# EAGLE schematic e-ink-display-v003 (EAGLE 7.3.0)
CNAME: e-ink-display; CREVISION: 0.0.3; DESIGNER: kennethlimcp

## Sheet 1 of 4: Power supply
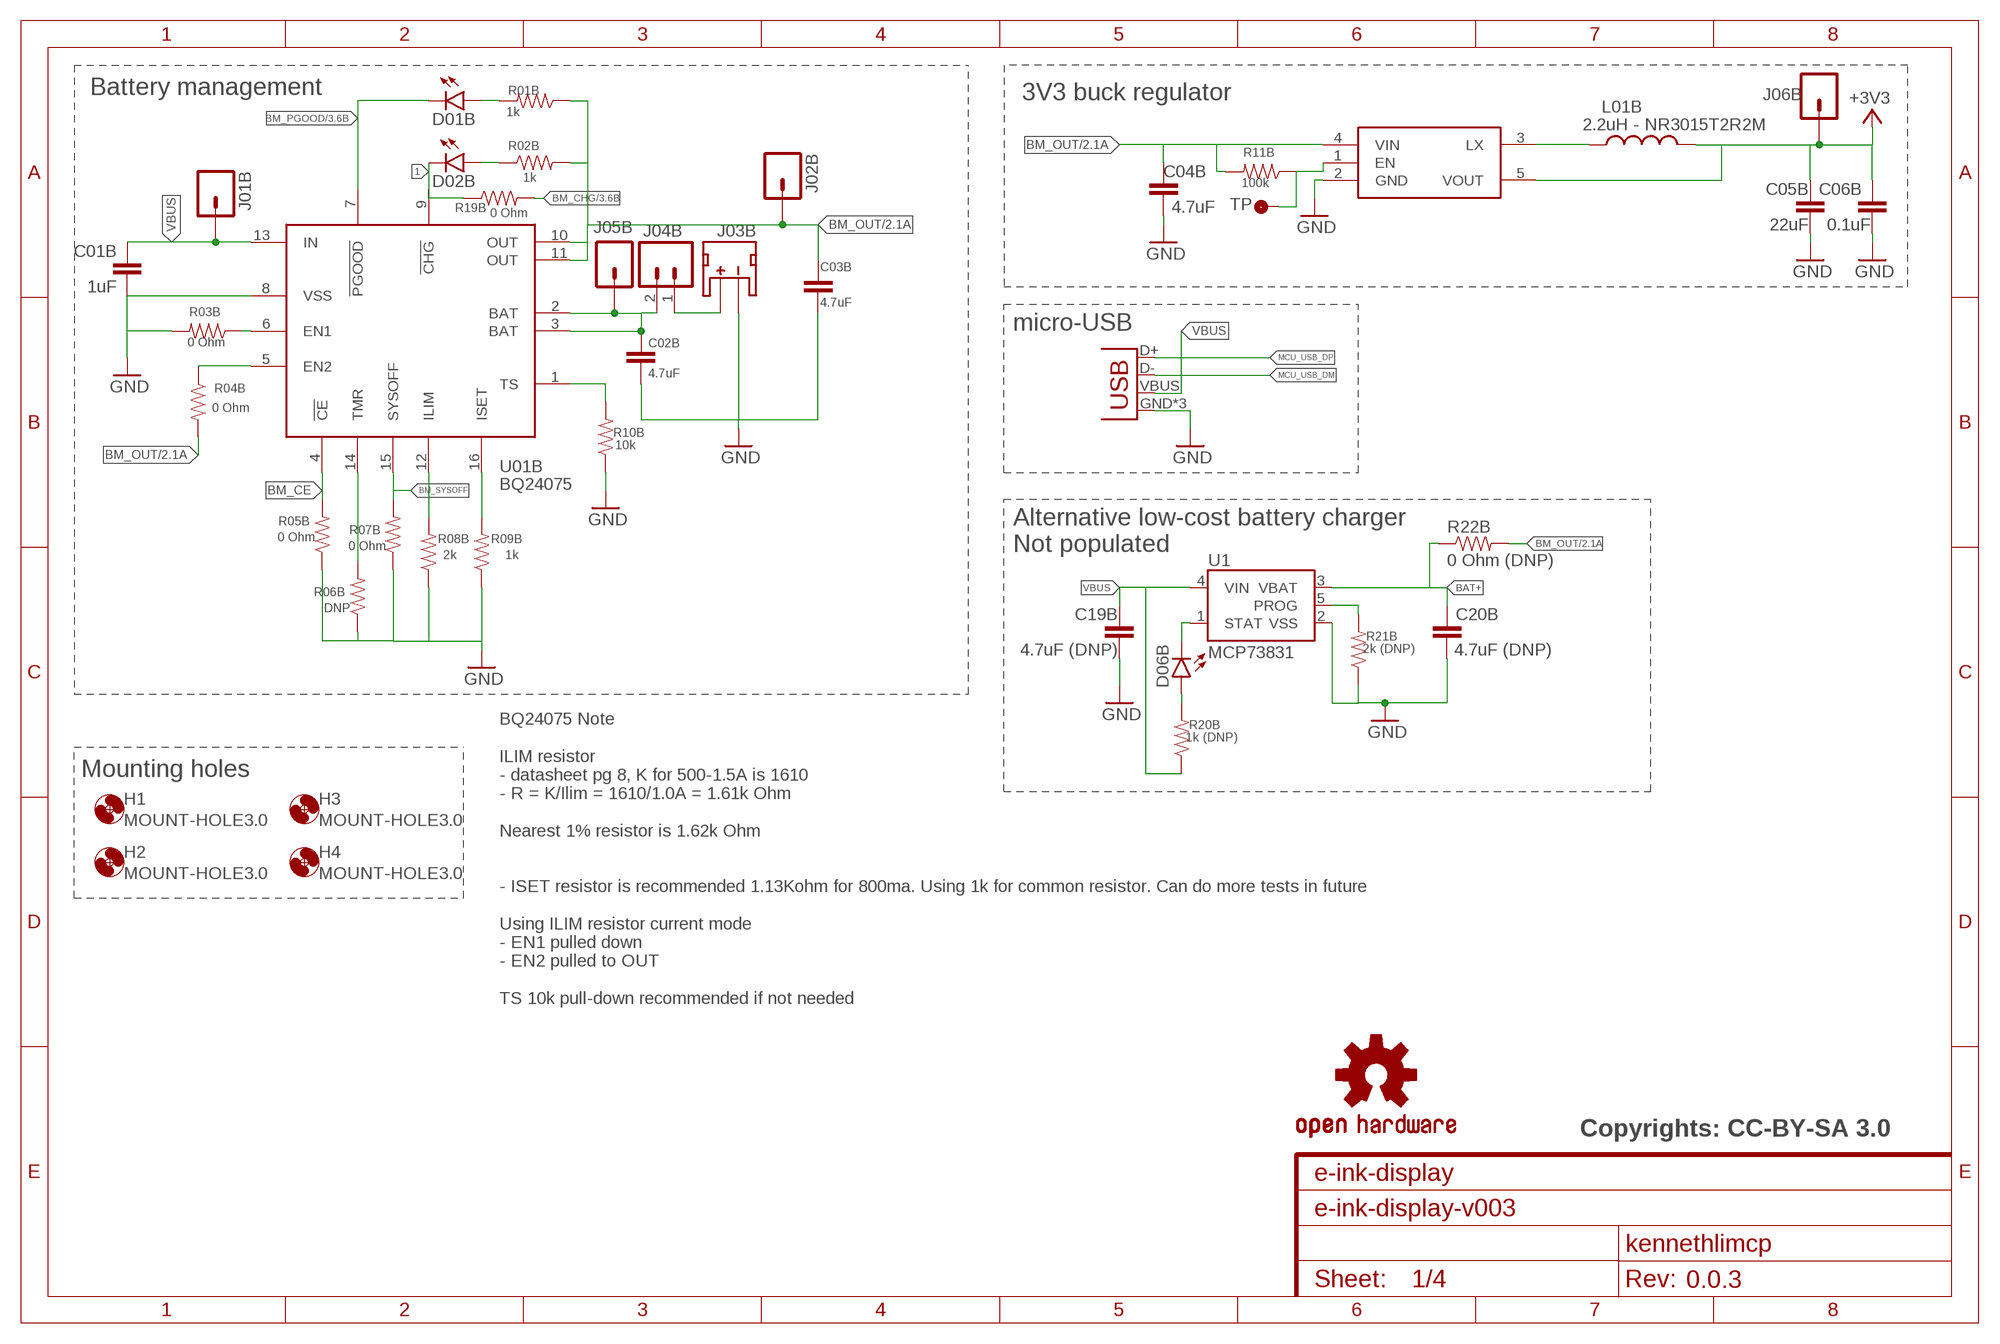
[diagram p0: schematic, sheet 1]

### Parts
C01B  1uF  CAP0603-CAP  [0603-CAP]
C02B  4.7uF  CAP0603-CAP  [0603-CAP]
C03B  4.7uF  CAP0603-CAP  [0603-CAP]
C04B  4.7uF  CAP0603-CAP  [0603-CAP]
C05B  22uF  CAP0603-CAP  [0603-CAP]
C06B  0.1uF  CAP0603-CAP  [0603-CAP]
C19B  4.7uF (DNP)  CAP0603-CAP  [0603-CAP]
C20B  4.7uF (DNP)  CAP0603-CAP  [0603-CAP]
D01B  LED0603  [LED-0603]
D02B  LED0603  [LED-0603]
D06B  LED0603  [LED-0603]
H1  MOUNT-HOLE3.0  [3,0]
H2  MOUNT-HOLE3.0  [3,0]
H3  MOUNT-HOLE3.0  [3,0]
H4  MOUNT-HOLE3.0  [3,0]
J01B  M01PTH  [1X01]
J02B  M01PTH  [1X01]
J03B  JST_2MM_MALE  [JST-2-SMD]
J04B  M02PTH  [1X02]
J05B  M01PTH  [1X01]
J06B  M01PTH  [1X01]
J07B  USBUSB-MICROB-SLOT-HOLE  [USB-MICROB-SLOT-HOLE]
L01B  2.2uH - NR3015T2R2M  INDUCTOR-SPARKFUNNR3015T4R7M  [INDUCTOR-NR3015]
LOGO1  OSHW-LOGOPAD  [OSHW-LOGO-M-PAD]
R01B  1k  RESISTOR0603-RES  [0603-RES]
R02B  1k  RESISTOR0603-RES  [0603-RES]
R03B  0 Ohm  RESISTOR0603-RES  [0603-RES]
R04B  0 Ohm  RESISTOR0603  [0603-RES]
R05B  0 Ohm  RESISTOR0603  [0603-RES]
R06B  DNP  RESISTOR0603  [0603-RES]
R07B  0 Ohm  RESISTOR0603  [0603-RES]
R08B  2k  RESISTOR0603  [0603-RES]
R09B  1k  RESISTOR0603-RES  [0603-RES]
R10B  10k  RESISTOR0603  [0603-RES]
R11B  100k  RESISTOR0603  [0603-RES]
R19B  0 Ohm  RESISTOR0603  [0603-RES]
R20B  1k (DNP)  RESISTOR0603  [0603-RES]
R21B  2k (DNP)  RESISTOR0603  [0603-RES]
R22B  0 Ohm (DNP)  RESISTOR1206  [1206]
TP01B  TP1  [TP35_BOT]
U1  MCP73831  [SOT23-5]
U01B  BQ24075  [QFN-16]
U02B  R8008-33  [SOT23-5]

### Nets
1: D02B.C R19B.1 U01B.9(!CHG)
+3V3: C05B.2 C06B.2 J06B.1 L01B.2 U02B.5(VOUT) ; also sheet 3,4
BAT+: C20B.2 J03B.2(+) J04B.1 R22B.1 U1.3(VBAT)
BM_BAT: C02B.2 J04B.2 J05B.1 U01B.2(BAT) U01B.3(BAT)
BM_CE: R05B.2 U01B.4(!CE)
BM_CHG: R19B.2 ; also sheet 3
BM_OUT: C03B.2 C04B.2 J02B.1 R01B.1 R02B.2 R04B.2 R11B.2 R22B.2 U01B.10(OUT) U01B.11(OUT) U02B.4(VIN) ; also sheet 2
BM_PGOOD: D01B.C U01B.7(!PGOOD) ; also sheet 3
BM_SYSOFF: R07B.2 U01B.15(SYSOFF)
GND: C01B.1 C02B.1 C03B.1 C04B.1 C05B.1 C06B.1 C19B.1 C20B.1 J03B.1(-) J07B.GND J07B.MT1(GND) J07B.MT2(GND) R03B.2 R05B.1 R06B.1 R07B.1 R08B.1 R09B.1 R10B.1 R21B.1 U1.2(VSS) U01B.8(VSS) U02B.2(GND) ; also sheet 2,3,4
MCU_USB_DM: J07B.D-
MCU_USB_DP: J07B.D+
N$4: R08B.2 U01B.12(ILIM)
N$9: R09B.2 U01B.16(ISET)
N$11: R04B.1 U01B.5(EN2)
N$12: R03B.1 U01B.6(EN1)
N$13: R06B.2 U01B.14(TMR)
N$15: R10B.2 U01B.1(TS)
N$17: D02B.A R02B.1
N$18: D01B.A R01B.2
N$19: R21B.2 U1.5(PROG)
N$21: R11B.1 TP01B.P$1(TP) U02B.1(EN)
N$23: L01B.1 U02B.3(LX)
N$30: D06B.C U1.1(STAT)
N$37: D06B.A R20B.2
VBUS: C01B.2 C19B.2 J01B.1 J07B.VBUS R20B.1 U1.4(VIN) U01B.13(IN)
Unconnected: J03B.NC1(PAD1) J03B.NC2(PAD2)

### Notes on the sheet
- Battery management | 3V3 buck regulator
- micro-USB
- Alternative low-cost battery charger
  Not populated
- Mounting holes
- BQ24075 Note
  
  ILIM resistor
  - datasheet pg 8, K for 500-1.5A is 1610
  - R = K/Ilim = 1610/1.0A = 1.61k Ohm
  
  Nearest 1% resistor is 1.62k Ohm
  
  
  - ISET resistor is recommended 1.13Kohm for 800ma. Using 1k for common resistor. Can do more tests in future
  
  Using ILIM resistor current mode
  - EN1 pulled down
  - EN2 pulled to OUT
  
  TS 10k pull-down recommended if not needed
- Copyrights: CC-BY-SA 3.0

## Sheet 2 of 4: e-ink power supply
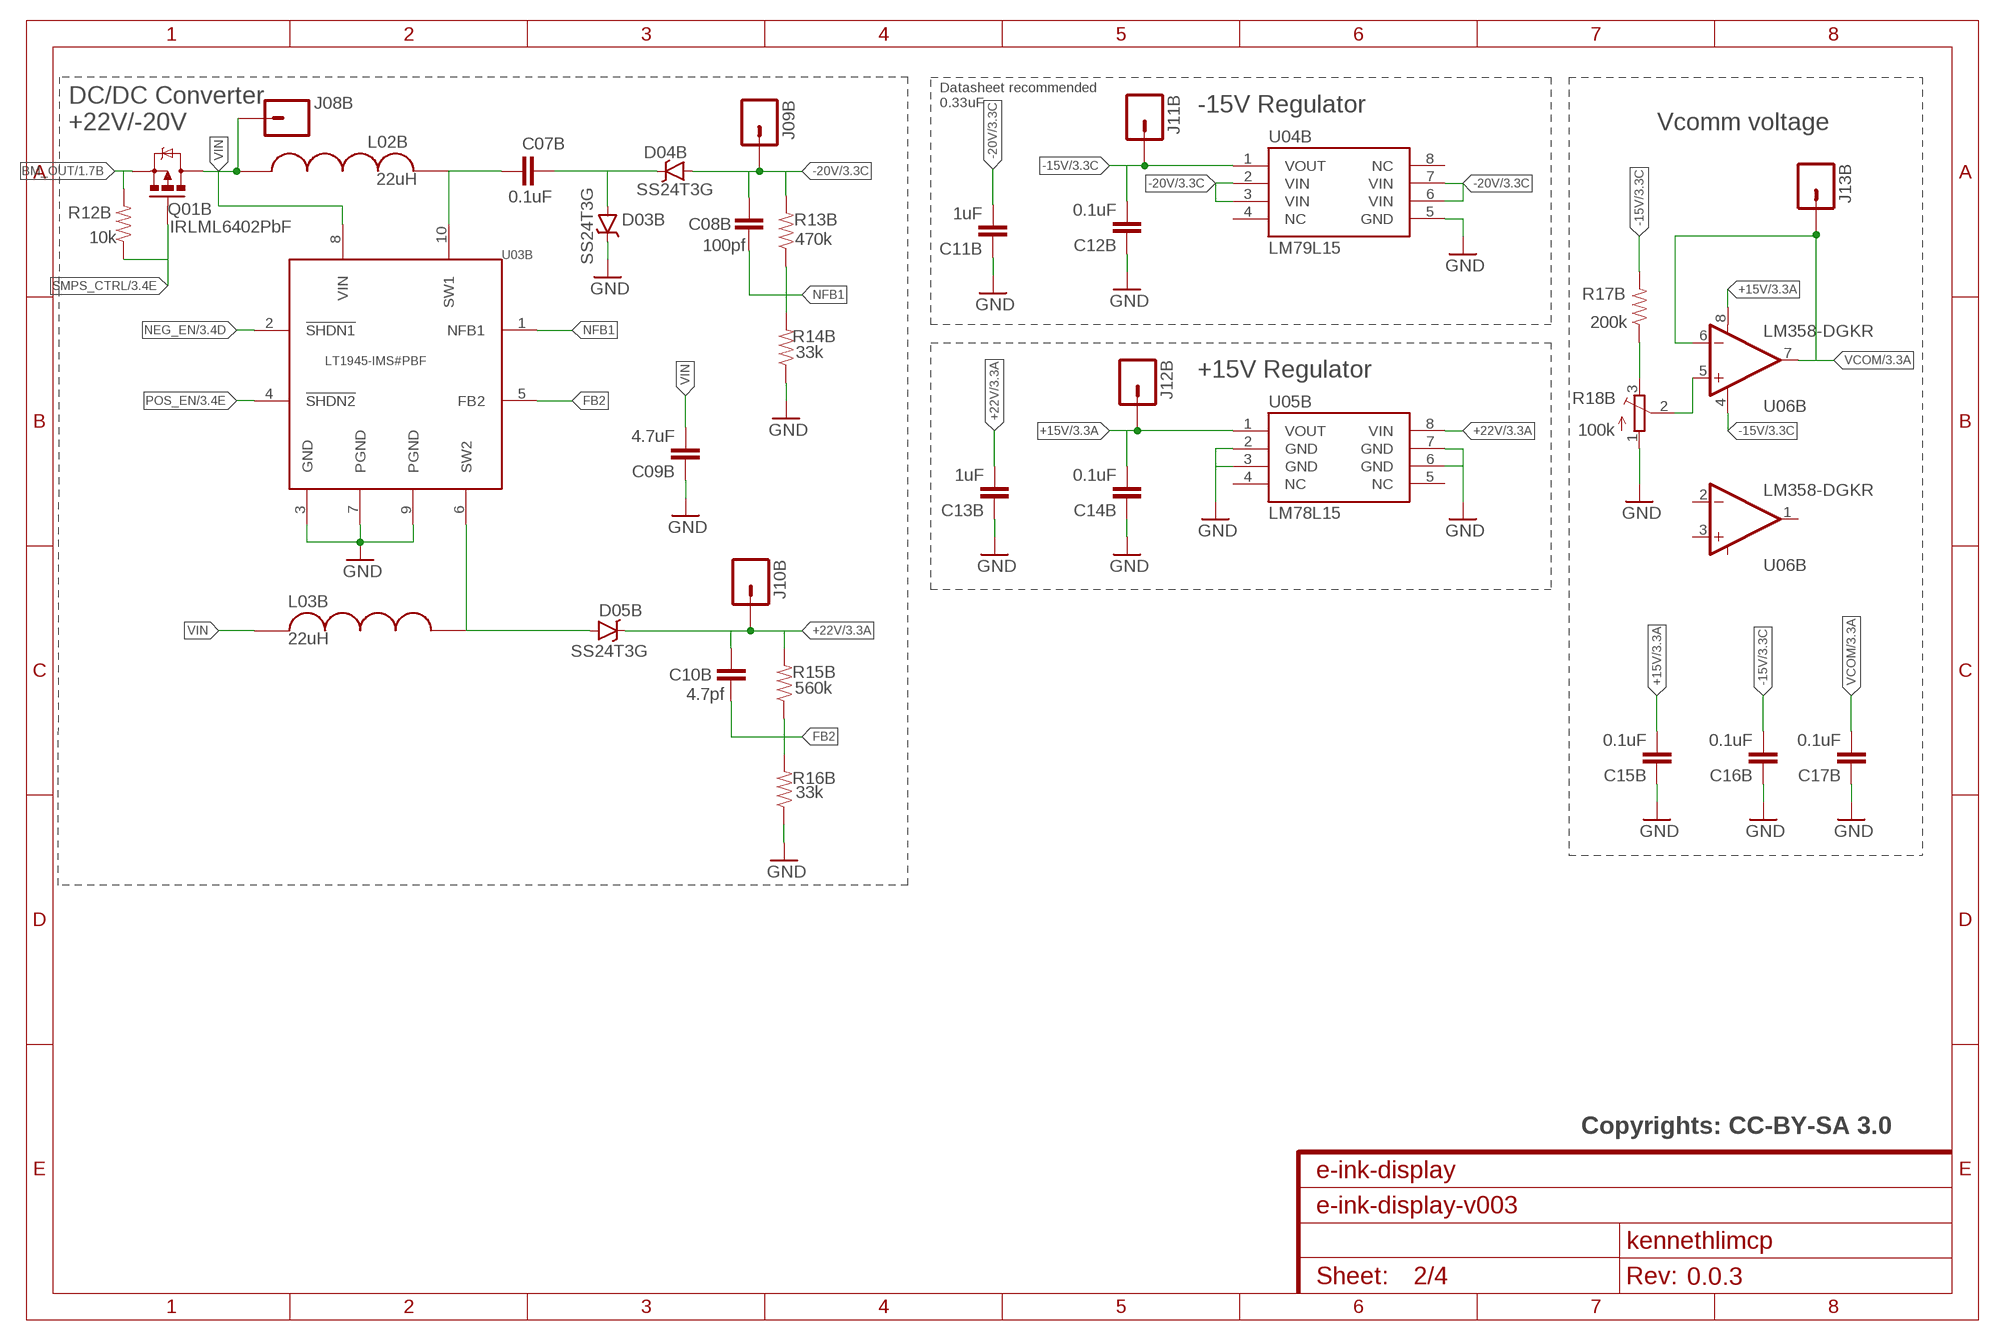
[diagram p1: schematic, sheet 2]

### Parts
C07B  0.1uF  CAP0603-CAP  [0603-CAP]
C08B  100pf  CAP0603-CAP  [0603-CAP]
C09B  4.7uF  CAP0603-CAP  [0603-CAP]
C10B  4.7pf  CAP0603-CAP  [0603-CAP]
C11B  1uF  CAP0603-CAP  [0603-CAP]
C12B  0.1uF  CAP0603-CAP  [0603-CAP]
C13B  1uF  CAP0603-CAP  [0603-CAP]
C14B  0.1uF  CAP0603-CAP  [0603-CAP]
C15B  0.1uF  CAP0603-CAP  [0603-CAP]
C16B  0.1uF  CAP0603-CAP  [0603-CAP]
C17B  0.1uF  CAP0603-CAP  [0603-CAP]
D03B  SS24T3G  [SMA-DIODE]
D04B  SS24T3G  [SMA-DIODE]
D05B  SS24T3G  [SMA-DIODE]
J08B  M01PTH  [1X01]
J09B  M01PTH  [1X01]
J10B  M01PTH  [1X01]
J11B  M01PTH  [1X01]
J12B  M01PTH  [1X01]
J13B  M01PTH  [1X01]
L02B  22uH  INDUCTOR  [4040(1515)]
L03B  22uH  INDUCTOR  [4040(1515)]
Q01B  IRLML6402PbF  MOSFET-PCHANNELSMD  [SOT23-3]
R12B  10k  RESISTOR0603  [0603-RES]
R13B  470k  RESISTOR0603  [0603-RES]
R14B  33k  RESISTOR0603  [0603-RES]
R15B  560k  RESISTOR0603  [0603-RES]
R16B  33k  RESISTOR0603  [0603-RES]
R17B  200k  RESISTOR0603  [0603-RES]
R18B  100k  TRIMPOTTC33X  [TC33X]
U03B  LT1945-IMS#PBF  [MSOP-10]
U04B  LM79L15  [SO08]
U05B  LM78L15  [SO08]
U06B  LM358-DGKR  [MSOP-8]

### Nets
+15V: C14B.2 C15B.2 J12B.1 U05B.1(VOUT) U06B.8(V+) ; also sheet 3
+22V: C10B.2 C13B.2 D05B.C J10B.1 R15B.2 U05B.8(VIN) ; also sheet 3
-15V: C12B.2 C16B.2 J11B.1 R17B.2 U04B.1(VOUT) U06B.4(V-) ; also sheet 3
-20V: C08B.2 C11B.2 D04B.A J09B.1 R13B.2 U04B.2(VIN) U04B.3(VIN) U04B.6(VIN) U04B.7(VIN) ; also sheet 3
BM_OUT: Q01B.2(S) R12B.2 ; also sheet 1
FB2: C10B.1 R15B.1 R16B.2 U03B.5(FB2)
GND: C09B.1 C11B.1 C12B.1 C13B.1 C14B.1 C15B.1 C16B.1 C17B.1 D03B.C R14B.1 R16B.1 R18B.1(A) U03B.3(GND) U03B.7(PGND) U03B.9(PGND) U04B.5(GND) U05B.2(GND) U05B.3(GND) U05B.6(GND) U05B.7(GND) ; also sheet 1,3,4
N$2: C07B.1 L02B.P$2 U03B.10(SW1)
N$3: C07B.2 D03B.A D04B.C
N$6: R18B.2(S) U06B.5(+IN2)
N$7: R17B.1 R18B.3(E)
N$8: D05B.A L03B.P$2 U03B.6(SW2)
NEG_EN: U03B.2(!SHDN1) ; also sheet 3
NFB1: C08B.1 R13B.1 R14B.2 U03B.1(NFB1)
POS_EN: U03B.4(!SHDN2) ; also sheet 3
SMPS_CTRL: Q01B.1(G) R12B.1 ; also sheet 3
VCOM: C17B.2 J13B.1 U06B.6(-IN2) U06B.7(OUT2) ; also sheet 3
VIN: C09B.2 J08B.1 L02B.P$1 L03B.P$1 Q01B.3(D) U03B.8(VIN)
Unconnected: U04B.4(NC) U04B.8(NC) U05B.4(NC) U05B.5(NC) U06B.1(OUT1) U06B.2(-IN1) U06B.3(+IN1)

### Notes on the sheet
- Datasheet recommended
  0.33uF
- -15V Regulator
- DC/DC Converter
  +22V/-20V
- Vcomm voltage
- +15V Regulator
- Copyrights: CC-BY-SA 3.0

## Sheet 3 of 4: e-ink display & MCU
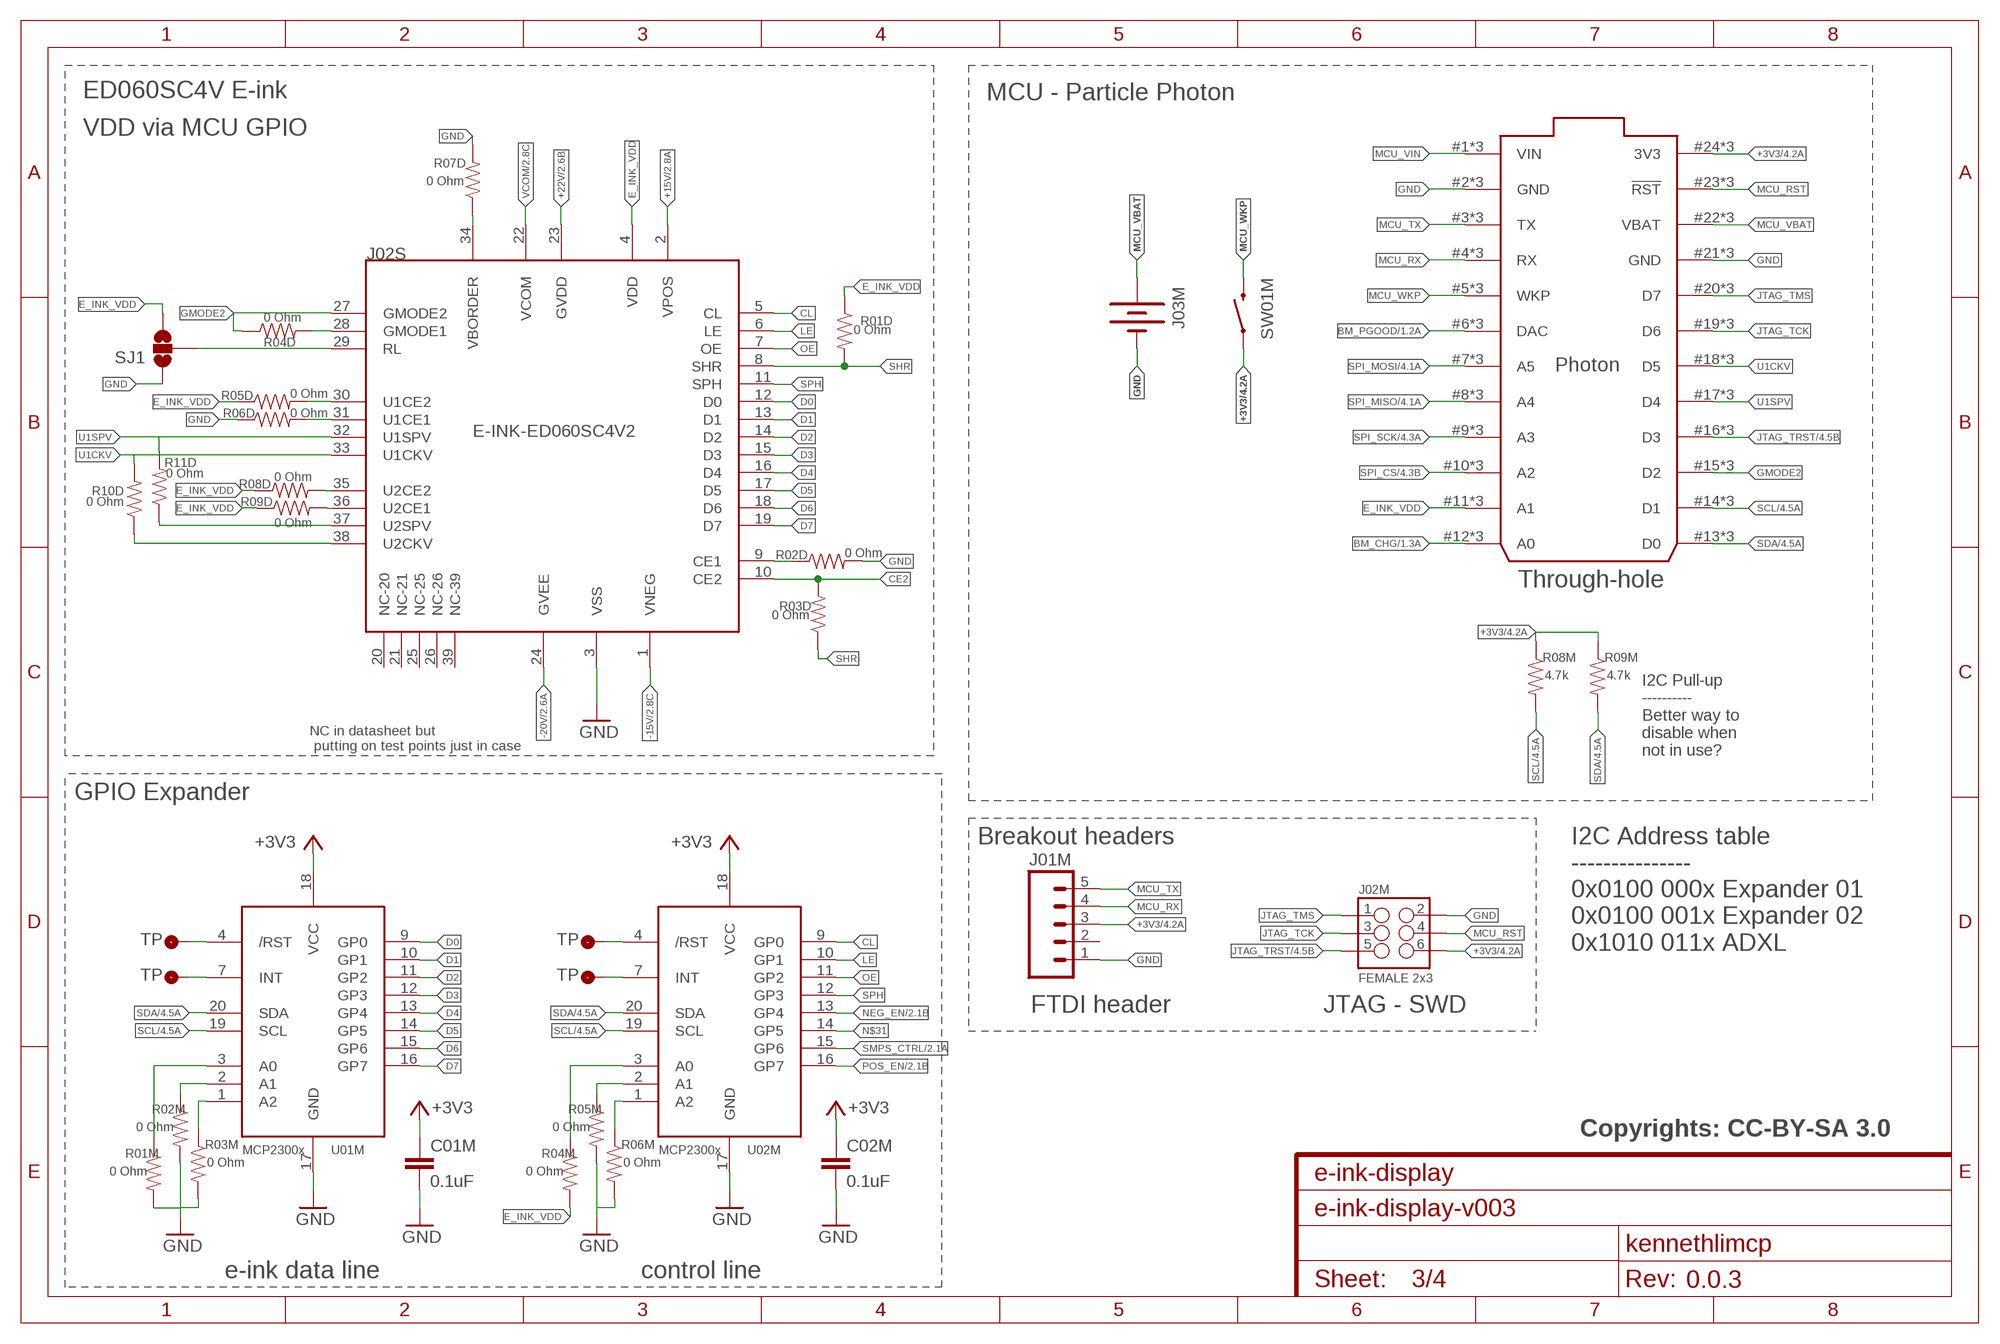
[diagram p2: schematic, sheet 3]

### Parts
C01M  0.1uF  CAP0603-CAP  [0603-CAP]
C02M  0.1uF  CAP0603-CAP  [0603-CAP]
J01M  M05PTH  [1X05]
J02M  FEMALE 2x3  M03X2FEMALE  [2X3]
J02S  E-INK-ED060SC4V2  [FPC-0.3-39]
J03M  BATTERY20PTH  [BATTCOM_20MM_PTH]
R01D  0 Ohm  RESISTOR0603-RES  [0603-RES]
R01M  0 Ohm  RESISTOR0603-RES  [0603-RES]
R02D  0 Ohm  RESISTOR0603-RES  [0603-RES]
R02M  0 Ohm  RESISTOR0603-RES  [0603-RES]
R03D  0 Ohm  RESISTOR0603-RES  [0603-RES]
R03M  0 Ohm  RESISTOR0603-RES  [0603-RES]
R04D  0 Ohm  RESISTOR0603-RES  [0603-RES]
R04M  0 Ohm  RESISTOR0603-RES  [0603-RES]
R05D  0 Ohm  RESISTOR0603-RES  [0603-RES]
R05M  0 Ohm  RESISTOR0603-RES  [0603-RES]
R06D  0 Ohm  RESISTOR0603-RES  [0603-RES]
R06M  0 Ohm  RESISTOR0603-RES  [0603-RES]
R07D  0 Ohm  RESISTOR0603-RES  [0603-RES]
R08D  0 Ohm  RESISTOR0603-RES  [0603-RES]
R08M  4.7k  RESISTOR0603-RES  [0603-RES]
R09D  0 Ohm  RESISTOR0603-RES  [0603-RES]
R09M  4.7k  RESISTOR0603-RES  [0603-RES]
R10D  0 Ohm  RESISTOR0603-RES  [0603-RES]
R11D  0 Ohm  RESISTOR0603-RES  [0603-RES]
SJ1  SOLDERJUMPER_2WAYT  [SJ_2]
SW01M  SWITCH-MOMENTARY-2PTH  [TACTILE-PTH]
U01M  MCP2300X/QFN  [QFN-20(4X4)]
U02M  MCP2300X/QFN  [QFN-20(4X4)]
U03M  PHOTON_WITH_STACKABLE_HEADERS  [PHOTON_STACKABLE]
U$1  TP1  [TP35_BOT]
U$2  TP1  [TP35_BOT]
U$3  TP1  [TP35_BOT]
U$4  TP1  [TP35_BOT]

### Nets
+3V3: C01M.1 C02M.1 J01M.3 J02M.6 R08M.1 R09M.1 SW01M.1 U01M.18(VCC) U02M.18(VCC) U03M.24(3V3) U03M.#24(3V3) U03M.@24(3V3) ; also sheet 1,4
+15V: J02S.2(VPOS) ; also sheet 2
+22V: J02S.23(GVDD) ; also sheet 2
-15V: J02S.1(VNEG) ; also sheet 2
-20V: J02S.24(GVEE) ; also sheet 2
BM_CHG: U03M.12(A0) U03M.#12(A0) U03M.@12(A0) ; also sheet 1
BM_PGOOD: U03M.6(DAC) U03M.#6(DAC) U03M.@6(DAC) ; also sheet 1
CE2: J02S.10(CE2) R03D.2
CL: J02S.5(CL) U02M.9(GP0)
D0: J02S.12(D0) U01M.9(GP0)
D1: J02S.13(D1) U01M.10(GP1)
D2: J02S.14(D2) U01M.11(GP2)
D3: J02S.15(D3) U01M.12(GP3)
D4: J02S.16(D4) U01M.13(GP4)
D5: J02S.17(D5) U01M.14(GP5)
D6: J02S.18(D6) U01M.15(GP6)
D7: J02S.19(D7) U01M.16(GP7)
E_INK_VDD: J02S.4(VDD) R01D.1 R04M.2 R05D.1 R08D.1 R09D.1 SJ1.3 U03M.11(A1) U03M.#11(A1) U03M.@11(A1)
GMODE2: J02S.27(GMODE2) R04D.1 U03M.15(D2) U03M.#15(D2) U03M.@15(D2)
GND: C01M.2 C02M.2 J01M.1 J02M.2 J02S.3(VSS) J03M.2(-) R01M.2 R02D.2 R02M.2 R03M.2 R05M.2 R06D.1 R06M.2 R07D.2 SJ1.1 U01M.17(GND) U02M.17(GND) U03M.2(GND) U03M.21(GND) U03M.#2(GND) U03M.#21(GND) U03M.@2(GND) U03M.@21(GND) ; also sheet 1,2,4
JTAG_TCK: J02M.3 U03M.19(D6) U03M.#19(D6) U03M.@19(D6)
JTAG_TMS: J02M.1 U03M.20(D7) U03M.#20(D7) U03M.@20(D7)
JTAG_TRST: J02M.5 U03M.16(D3) U03M.#16(D3) U03M.@16(D3) ; also sheet 4
LE: J02S.6(LE) U02M.10(GP1)
MCU_RST: J02M.4 U03M.23(!RST) U03M.#23(!RST) U03M.@23(!RST)
MCU_RX: J01M.4 U03M.4(RX) U03M.#4(RX) U03M.@4(RX)
MCU_TX: J01M.5 U03M.3(TX) U03M.#3(TX) U03M.@3(TX)
MCU_VBAT: J03M.1(+) U03M.22(VBAT) U03M.#22(VBAT) U03M.@22(VBAT)
MCU_VIN: U03M.1(VIN) U03M.#1(VIN) U03M.@1(VIN)
MCU_WKP: SW01M.3 U03M.5(WKP) U03M.#5(WKP) U03M.@5(WKP)
N$1: J02S.28(GMODE1) R04D.2
N$5: J02S.31(U1CE1) R06D.2
N$14: U01M.4(/RST) U$1.P$1(TP)
N$16: U01M.7(INT) U$2.P$1(TP)
N$20: U02M.4(/RST) U$3.P$1(TP)
N$22: U02M.7(INT) U$4.P$1(TP)
N$24: R03M.1 U01M.1(A2)
N$25: R01M.1 U01M.3(A0)
N$26: J02S.35(U2CE2) R08D.2
N$27: J02S.36(U2CE1) R09D.2
N$28: J02S.9(CE1) R02D.1
N$29: J02S.34(VBORDER) R07D.1
N$31: U02M.14(GP5)
N$32: R06M.1 U02M.1(A2)
N$33: R05M.1 U02M.2(A1)
N$34: R04M.1 U02M.3(A0)
N$35: R02M.1 U01M.2(A1)
NEG_EN: U02M.13(GP4) ; also sheet 2
OE: J02S.7(OE) U02M.11(GP2)
POS_EN: U02M.16(GP7) ; also sheet 2
RL: J02S.29(RL) SJ1.2
SCL: R08M.2 U01M.19(SCL) U02M.19(SCL) U03M.14(D1) U03M.#14(D1) U03M.@14(D1) ; also sheet 4
SDA: R09M.2 U01M.20(SDA) U02M.20(SDA) U03M.13(D0) U03M.#13(D0) U03M.@13(D0) ; also sheet 4
SHR: J02S.8(SHR) R01D.2 R03D.1
SMPS_CTRL: U02M.15(GP6) ; also sheet 2
SPH: J02S.11(SPH) U02M.12(GP3)
SPI_CS: U03M.10(A2) U03M.#10(A2) U03M.@10(A2) ; also sheet 4
SPI_MISO: U03M.8(A4) U03M.#8(A4) U03M.@8(A4) ; also sheet 4
SPI_MOSI: U03M.7(A5) U03M.#7(A5) U03M.@7(A5) ; also sheet 4
SPI_SCK: U03M.9(A3) U03M.#9(A3) U03M.@9(A3) ; also sheet 4
U1CE2: J02S.30(U1CE2) R05D.2
U1CKV: J02S.33(U1CKV) R10D.2 U03M.18(D5) U03M.#18(D5) U03M.@18(D5)
U1SPV: J02S.32(U1SPV) R11D.2 U03M.17(D4) U03M.#17(D4) U03M.@17(D4)
U2CKV: J02S.38(U2CKV) R10D.1
U2SPV: J02S.37(U2SPV) R11D.1
VCOM: J02S.22(VCOM) ; also sheet 2
Unconnected: J01M.2 J02S.20(NC-20) J02S.21(NC-21) J02S.25(NC-25) J02S.26(NC-26) J02S.39(NC-39)

### Notes on the sheet
- MCU - Particle Photon
- ED060SC4V E-ink
  
  VDD via MCU GPIO
- Through-hole
- NC in datasheet but
   putting on test points just in case
- I2C Pull-up
  ----------
  Better way to 
  disable when 
  not in use?
- GPIO Expander
- Breakout headers
- I2C Address table
  ---------------
  0x0100 000x Expander 01
  0x0100 001x Expander 02
  0x1010 011x ADXL
- FTDI header | JTAG - SWD
- Copyrights: CC-BY-SA 3.0
- e-ink data line | control line

## Sheet 4 of 4: Peripherals
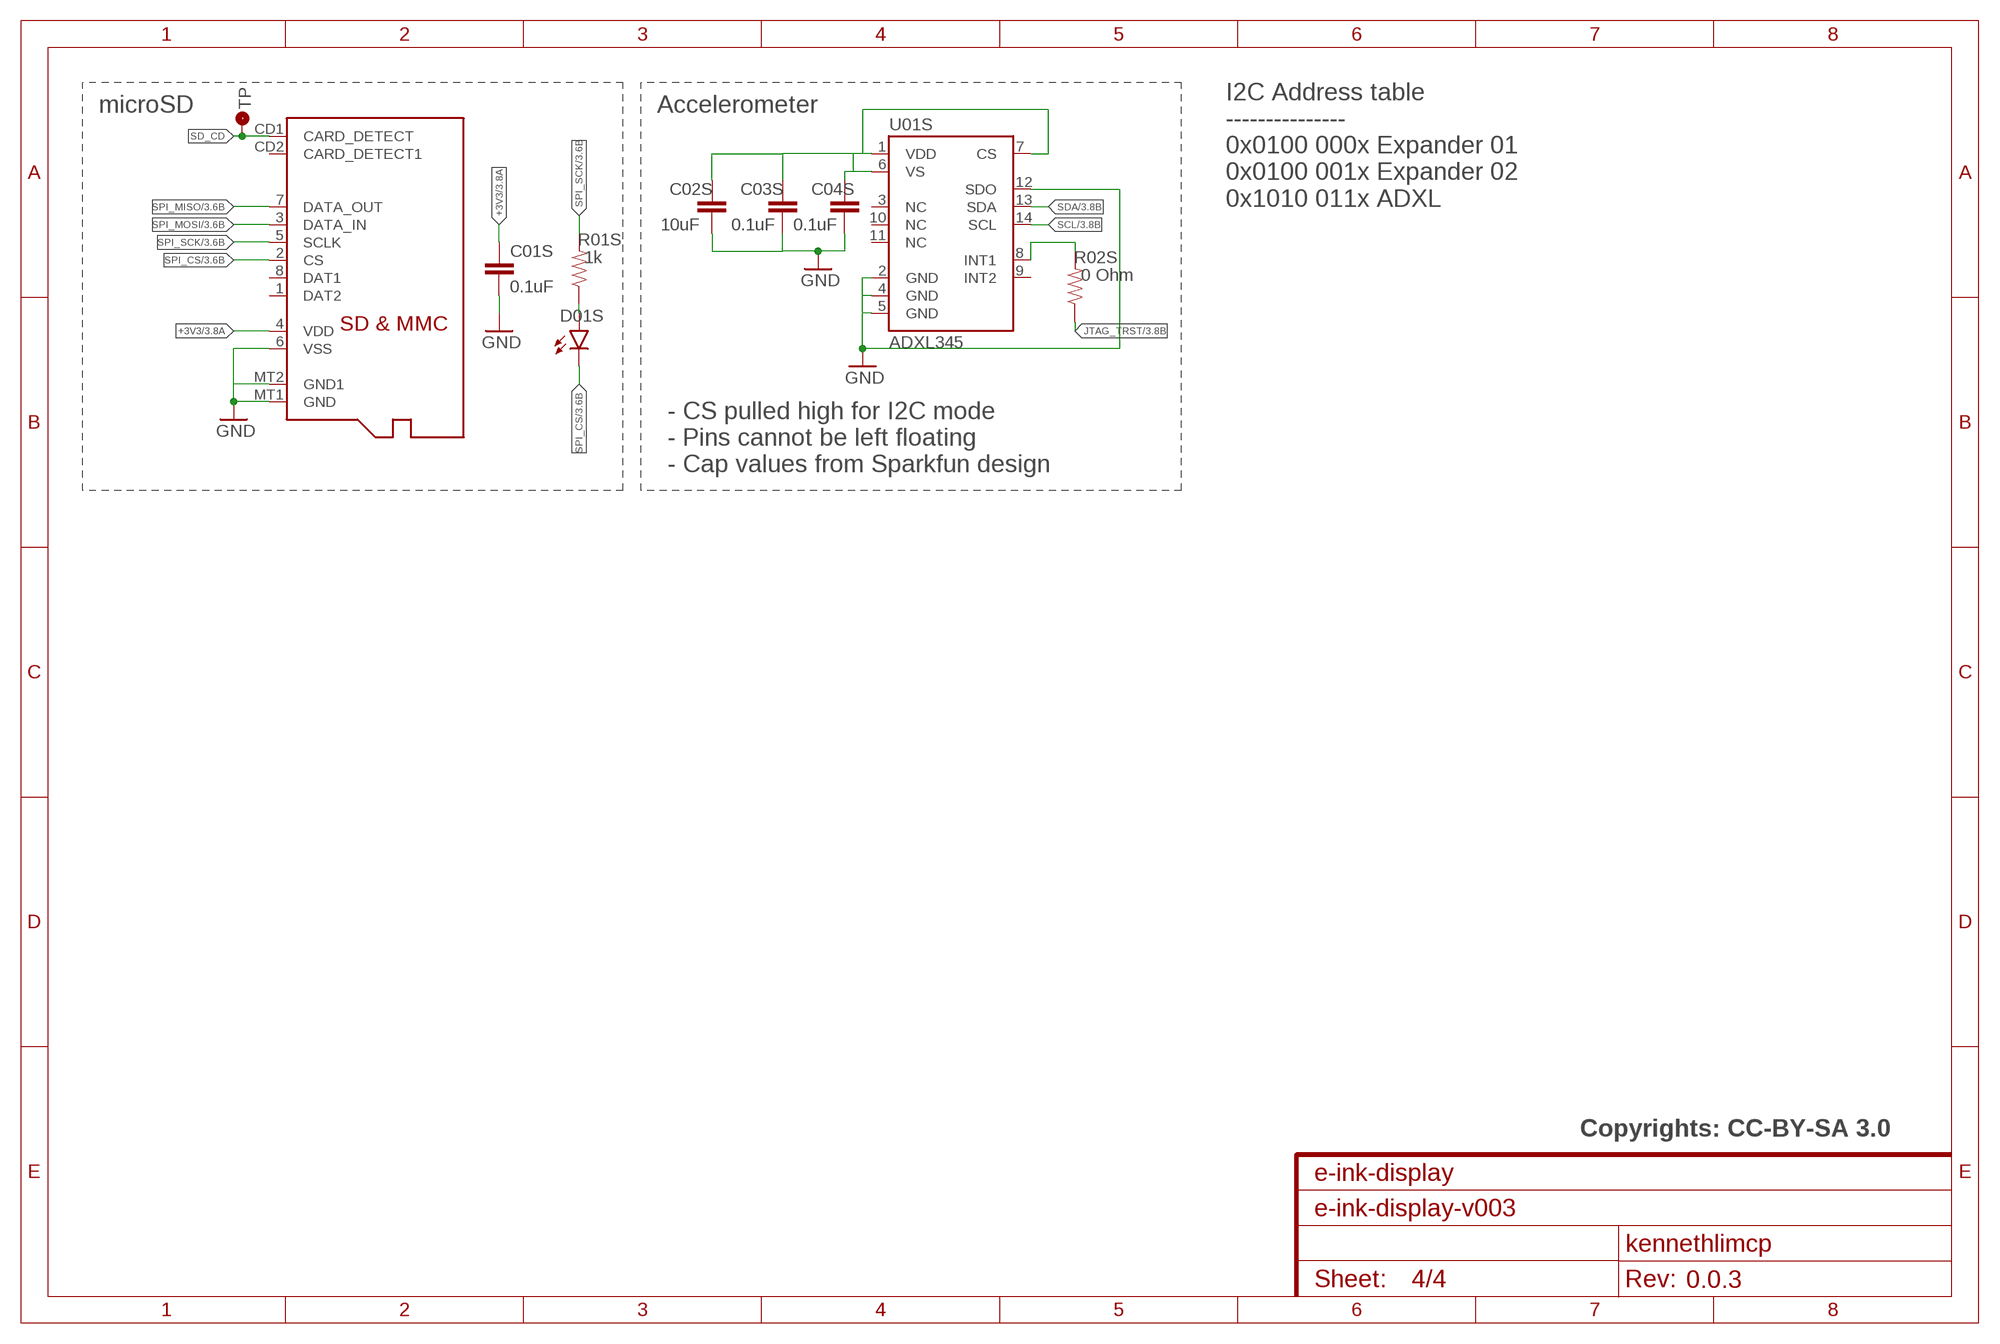
[diagram p3: schematic, sheet 4]

### Parts
C01S  0.1uF  CAP0603-CAP  [0603-CAP]
C02S  10uF  CAP0603-CAP  [0603-CAP]
C03S  0.1uF  CAP0603-CAP  [0603-CAP]
C04S  0.1uF  CAP0603-CAP  [0603-CAP]
D01S  LED0603  [LED-0603]
J01S  MICROSD  [MICROSD]
R01S  1k  RESISTOR0603-RES  [0603-RES]
R02S  0 Ohm  RESISTOR0603  [0603-RES]
U01S  ADXL345  [LGA14]
U$5  TP3  [TP60_BOT]

### Nets
+3V3: C01S.1 J01S.4(VDD) ; also sheet 1,3
GND: C01S.2 C02S.2 C03S.2 C04S.2 J01S.6(VSS) J01S.MT1(GND) J01S.MT2(GND1) U01S.2(GND) U01S.4(GND) U01S.5(GND) U01S.12(SDO) ; also sheet 1,2,3
JTAG_TRST: R02S.1 ; also sheet 3
N$10: R02S.2 U01S.8(INT1)
N$36: C02S.1 C03S.1 C04S.1 U01S.1(VDD) U01S.6(VS) U01S.7(CS)
R01S: D01S.A R01S.1
SCL: U01S.14(SCL) ; also sheet 3
SD_CD: J01S.CD1(CARD_DETECT) U$5.P$1(TP)
SDA: U01S.13(SDA) ; also sheet 3
SPI_CS: D01S.C J01S.2(CS) ; also sheet 3
SPI_MISO: J01S.7(DATA_OUT) ; also sheet 3
SPI_MOSI: J01S.3(DATA_IN) ; also sheet 3
SPI_SCK: J01S.5(SCLK) R01S.2 ; also sheet 3
Unconnected: J01S.1(DAT2) J01S.8(DAT1) J01S.CD2(CARD_DETECT1) U01S.3(NC) U01S.9(INT2) U01S.10(NC) U01S.11(NC)

### Notes on the sheet
- microSD | Accelerometer
- I2C Address table
  ---------------
  0x0100 000x Expander 01
  0x0100 001x Expander 02
  0x1010 011x ADXL
- - CS pulled high for I2C mode
  - Pins cannot be left floating
  - Cap values from Sparkfun design
- Copyrights: CC-BY-SA 3.0

## Library data of the parts
C01B C01M C01S C02B C02M C02S C03B C03S C04B C04S C05B C06B C07B C08B C09B C10B C11B C12B C13B C14B C15B C16B C17B C19B C20B = SparkFun-Capacitors:CAP: Capacitor Standard 0603 ceramic capacitor, and 0.1" leaded capacitor.
D01B D01S D02B D06B = SparkFun-LED:LED: LEDs Standard schematic elements and footprints for 5mm, 3mm, 1206, and 0603 sized LEDs. 5mm - Spark Fun Electronics SKU : COM-00529 (and others)
D03B D04B D05B = kennethlimcp:SS24T3G: SS24T3G, Schottky diode 40V, 1A, Vf 500mV Package: DO-214AA
H1-H4 = holes:MOUNT-HOLE: MOUNTING HOLE with drill center marker
J01B J02B J05B J06B J08B J09B J10B J11B J12B J13B = SparkFun-Connectors:M01: Header 1 Standard 1-pin 0.1" header. Use with straight break away headers (SKU : PRT-00116), right angle break away headers (PRT-00553), swiss pins (PRT-00743), machine pins (PRT-00117), and female headers (PRT-00115).
J01M = SparkFun-Connectors:M05: Header 5 Standard 5-pin 0.1" header. Use with straight break away headers (SKU : PRT-00116), right angle break away headers (PRT-00553), swiss pins (PRT-00743), machine pins (PRT-00117), and female headers (PRT-00115). Molex polarized connector foot print use with SKU : PRT-08230 with associated crimp pins and housings.
J01S = adafruit:MICROSD: Micro-SD / Transflash card holder with SPI pinout For the 3M # 2908-05WB-MG and/or 4UCON #19656 push-push type
J02M = SparkFun-Connectors:M03X2: 2x3 .1" header. Shrouded, with keying- CONN-10681 SMT- CONN-11415 Pogo pins- HW-11044; PROD_ID: CONN-11566
J02S = kennethlimcp:E-INK-ED060SC4V2
J03B = SparkFun-Connectors:JST_2MM_MALE: Mates to single-cell LiPo batteries. CONN-11443 Now with smashable polarity marks!; BTM_NEG: -; BTM_POS: +; PROD_ID: CONN-11443; TOP_NEG: -; TOP_POS: +
J03M = SparkFun-Electromechanical:BATTERY: Battery Holders Various common sizes : AA, AAA, 18650 (PRT-12895), 20mm coin cell and 12mm coin cell. 20MM_4LEGS, BATT-10373
J04B = SparkFun-Connectors:M02: Standard 2-pin 0.1" header. Use with - straight break away headers ( PRT-00116) - right angle break away headers (PRT-00553) - swiss pins (PRT-00743) - machine pins (PRT-00117) - female headers (PRT-00115) Molex polarized connector foot print use with: PRT-08233 with associated crimp pins and housings. 2.54_SCREWTERM for use with PRT-10571. 3.5mm Screw Terminal footprints for PRT-08084 5mm Screw Terminal footprints for use with PRT-08432
J07B = Spark:USB
L01B = Spark:INDUCTOR-SPARKFUN: Inductors Basic Inductor/Choke - 0603 and 1206. Footprints are not proven and vary greatly between part numbers. SRN6045- 33uH, 20% 1.4A; NR3015T4R7M: 4.7uH
L02B L03B = kennethlimcp:INDUCTOR
LOGO1 = kennethlimcp:OSHW-LOGO: Open Source Hardware Logo This logo indicates the piece of hardware it is found on incorporates a OSHW license and/or adheres to the definition of open source hardware found here: http://freedomdefined.org/OSHW
Q01B = SparkFun-DiscreteSemi:MOSFET-PCHANNEL: Generic PMOSFET IRLML2244 - TRANS-11153 (SOT-23 -20V -4.3A) (1.Gate 2.Source 3.Drain) FQP27P06 - COM-10349 <http://www.sparkfun.com/products/10349> (TO-220 -60V -27A) (1.Gate 2.Source 3.Drain)
R01B R01S R02B R02S R03B R04B R05B R06B R07B R08B R09B R10B R11B R12B R13B R14B R15B R16B R17B R19B R20B R21B R22B = SparkFun-Resistors:RESISTOR: Resistor Basic schematic elements and footprints for 0603, 1206, and PTH resistors.
R01D R01M R02D R02M R03D R03M R04D R04M R05D R05M R06D R06M R07D R08D R08M R09D R09M R10D R11D = SparkFun-Passives:RESISTOR: Resistor Basic schematic elements and footprints for 0603, 1206, and PTH resistors.
R18B = adafruit:TRIMPOT: SMT trimmer potentiometer part number TC33X http://www.ladyada.net/library/eagle
SJ1 = SparkFun-Retired:SOLDERJUMPER_2WAY: Solder Jumper 2 way solder jumper
SW01M = SparkFun-Electromechanical:SWITCH-MOMENTARY-2: Various NO switches- pushbuttons, reed, etc; PROD_ID: SWCH-08441
TP01B U$1-U$5 = Spark:TP: Test Points of all sizes and shapes
U1 = SparkFun-PowerIC:MCP73831: Miniature single cell, fully integrated Li-Ion, Li-polymer charge management controller http://ww1.microchip.com/downloads/en/DeviceDoc/20001984g.pdf IC-09995; PROD_ID: IC-09995
U01B = kennethlimcp:BQ2407: 1.5-A USB-Friendly Li-Ion Battery Charger and Power-Path Management IC Series: bq24072, bq24073, bq24074, bq24075, bq24079
U01M U02M = kennethlimcp:MCP2300X: MCP23008 Inexpensive i2c i/o expander - 8 general purpose i/o pins with optional pullups
U01S = SparkFun-Sensors:ADXL345: 3-axis SPI/I2C 2/4/8/16g accelerometer
U02B = Spark:R8008-33
U03B = kennethlimcp:LT1945: LT1945 36V switch, 350mA, Dual micropower DC/DC converter
U03M = Spark:PHOTON
U04B = kennethlimcp:LM79L15: LM79L15, SOIC-8
U05B = kennethlimcp:LM78L15: LM78L15, SOIC-8
U06B = kennethlimcp:LM358: LM358, two independent, high-gain, Wide Supply Ranges frequency-compensated operational amplifiers MSOP-8

## Net classes
0 default: clearance 0.205 mm